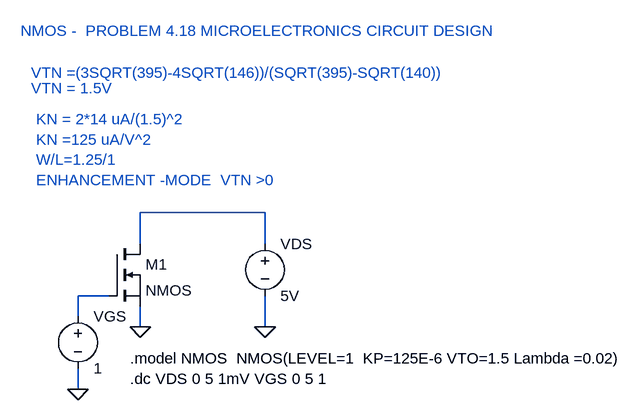
[diagram p0: schematic NMOS circuit.asc]
NMOS circuit.asc, the LTspice schematic file:
Version 4
SHEET 1 996 680
WIRE 384 32 192 32
WIRE 192 80 192 32
WIRE 384 80 384 32
WIRE 144 160 96 160
WIRE 96 192 96 160
WIRE 192 208 192 176
WIRE 384 208 384 160
WIRE 96 304 96 272
FLAG 96 304 0
FLAG 192 208 0
FLAG 384 208 0
SYMBOL nmos 144 80 R0
SYMATTR InstName M1
SYMBOL voltage 384 64 R0
WINDOW 123 0 0 Left 2
WINDOW 39 0 0 Left 2
SYMATTR InstName VDS
SYMATTR Value 5V
SYMBOL voltage 96 176 R0
WINDOW 123 0 0 Left 2
WINDOW 39 0 0 Left 2
SYMATTR InstName VGS
SYMATTR Value 1
TEXT 176 256 Left 2 !.model NMOS  NMOS(LEVEL=1  KP=125E-6 VTO=1.5 Lambda =0.02)
TEXT 176 288 Left 2 !.dc VDS 0 5 1mV VGS 0 5 1
TEXT 24 -184 Left 2 ;VTN =(3SQRT(395)-4SQRT(146))/(SQRT(395)-SQRT(140))
TEXT 24 -160 Left 2 ;VTN = 1.5V
TEXT 32 -112 Left 2 ;KN = 2*14 uA/(1.5)^2\nKN =125 uA/V^2\nW/L=1.25/1       \nENHANCEMENT -MODE  VTN >0
TEXT 8 -248 Left 2 ;NMOS -  PROBLEM 4.18 MICROELECTRONICS CIRCUIT DESIGN

The netlist it stands for:
* NMOS circuit.asc
M1 N001 N002 0 0 NMOS
VDS N001 0 5V
VGS N002 0 1
.model NMOS NMOS
.model PMOS PMOS
.lib standard.mos
.model NMOS  NMOS(LEVEL=1  KP=125E-6 VTO=1.5 Lambda =0.02)
.dc VDS 0 5 1mV VGS 0 5 1
* VTN =(3SQRT(395)-4SQRT(146))/(SQRT(395)-SQRT(140))
* VTN = 1.5V
* KN = 2*14 uA/(1.5)^2
* KN =125 uA/V^2
* W/L=1.25/1
* ENHANCEMENT -MODE  VTN >0
* NMOS -  PROBLEM 4.18 MICROELECTRONICS CIRCUIT DESIGN
.backanno
.end